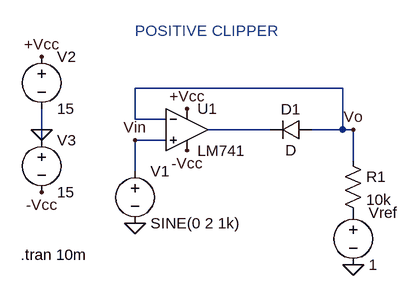
[diagram p0: schematic posclip.asc]
posclip.asc, the LTspice schematic file:
Version 4
SHEET 1 880 680
WIRE 480 48 160 48
WIRE 160 96 160 48
WIRE 208 96 160 96
WIRE 16 112 16 80
WIRE 368 112 272 112
WIRE 480 112 480 48
WIRE 480 112 432 112
WIRE 496 112 480 112
WIRE 16 128 16 112
WIRE 208 128 160 128
WIRE 496 160 496 112
WIRE 160 176 160 128
FLAG 16 112 0
FLAG 160 256 0
FLAG 240 80 +Vcc
FLAG 240 144 -Vcc
FLAG 16 0 +Vcc
FLAG 16 208 -Vcc
FLAG 496 320 0
FLAG 496 112 Vo
FLAG 160 128 Vin
SYMBOL Opamps\\LM741 240 48 R0
SYMATTR InstName U1
SYMATTR SpiceModel ""
SYMBOL diode 432 96 R90
WINDOW 0 0 32 VBottom 2
WINDOW 3 32 32 VTop 2
SYMATTR InstName D1
SYMBOL res 480 144 R0
SYMATTR InstName R1
SYMATTR Value 10k
SYMBOL voltage 160 160 R0
WINDOW 123 0 0 Left 2
WINDOW 39 0 0 Left 2
SYMATTR InstName V1
SYMATTR Value SINE(0 2 1k)
SYMBOL voltage 16 -16 R0
SYMATTR InstName V2
SYMATTR Value 15
SYMBOL voltage 16 112 R0
SYMATTR InstName V3
SYMATTR Value 15
SYMBOL voltage 496 224 R0
WINDOW 123 0 0 Left 2
WINDOW 39 0 0 Left 2
SYMATTR InstName Vref
SYMATTR Value 1
TEXT 160 -40 Left 2 ;POSITIVE CLIPPER
TEXT -16 304 Left 2 !.tran 10m

The netlist it stands for:
* posclip.asc
XU1 Vin Vo +Vcc -Vcc N001 LM741  ; pins In+ In- V+ V- OUT
D1 Vo N001 D
R1 Vo P001 10k
V1 Vin 0 SINE(0 2 1k)
V2 +Vcc 0 15
V3 0 -Vcc 15
Vref P001 0 1
.model D D
.lib standard.dio
* POSITIVE CLIPPER
.tran 10m
.lib LM741.lib
.backanno
.end